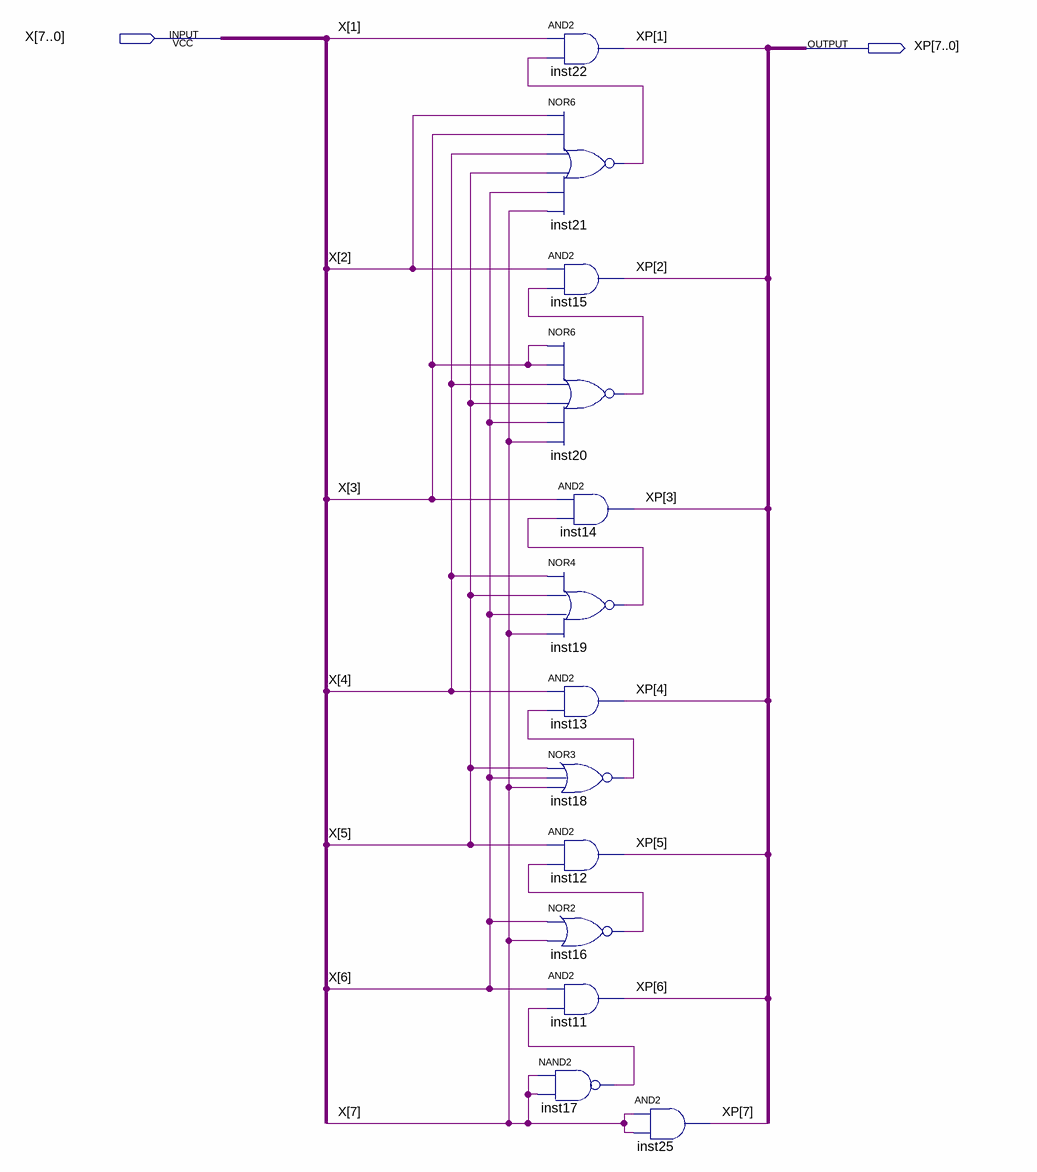
[diagram p0: schematic sheet]
// Quartus schematic prio.bdf as structural Verilog: 13 symbols, 2 pins
module prio (
  input  [7:0] X,
  output [7:0] XP
);

  wire inst16_out, inst17_out, inst18_out, inst19_out, inst20_out, inst21_out;

  and inst22 (XP[1], X[1], inst21_out);
  nor inst21 (inst21_out, X[2], X[3], X[4], X[5], X[6], X[7]);
  and inst15 (XP[2], X[2], inst20_out);
  nor inst20 (inst20_out, X[3], X[3], X[4], X[5], X[6], X[7]);
  and inst14 (XP[3], X[3], inst19_out);
  nor inst19 (inst19_out, X[4], X[5], X[6], X[7]);
  and inst13 (XP[4], X[4], inst18_out);
  nor inst18 (inst18_out, X[5], X[6], X[7]);
  and inst12 (XP[5], X[5], inst16_out);
  nor inst16 (inst16_out, X[6], X[7]);
  and inst11 (XP[6], X[6], inst17_out);
  nand inst17 (inst17_out, X[7], X[7]);
  and inst25 (XP[7], X[7], X[7]);
endmodule
